# Altium schematic sheet TOP.SchDoc
size A4
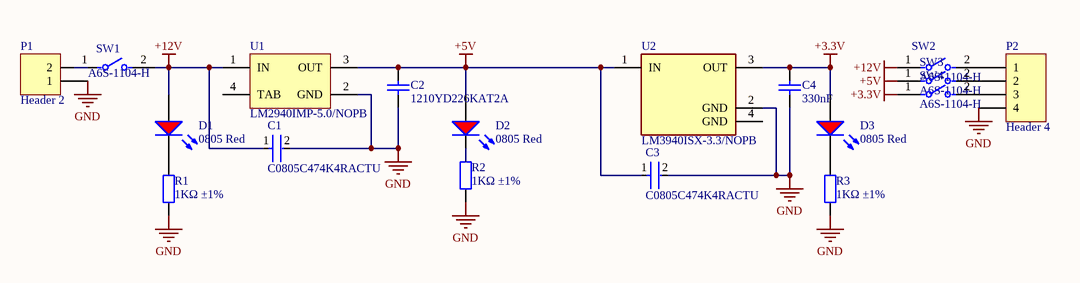
[diagram p0: TOP.SchDoc]

## Parts
C1  C0805C474K4RACTU  [FP-C0805C-DN-MFG]
C2  1210YD226KAT2A  [CAPC3225X279X50LL20T25]
C3  C0805C474K4RACTU  [FP-C0805C-DN-MFG]
C4  330nF  [0603_C]
D1  0805 Red  [0805_LED_S1]
D2  0805 Red  [0805_LED_S1]
D3  0805 Red  [0805_LED_S1]
P1  Header 2  [HDR1X2]
P2  Header 4  [HDR1X4]
R1  1KΩ ±1%  [0805_R]
R2  1KΩ ±1%  [0805_R]
R3  1KΩ ±1%  [0805_R]
SW1  A6S-1104-H  [FP-A6S-1104-H-MFG]
SW2  A6S-1104-H  [FP-A6S-1104-H-MFG]
SW3  A6S-1104-H  [FP-A6S-1104-H-MFG]
SW4  A6S-1104-H  [FP-A6S-1104-H-MFG]
U1  LM2940IMP-5.0/NOPB  [DCY0004A_M]
U2  LM3940ISX-3.3/NOPB  [FP-KTT0003B-MFG]

## Nets
+3.3V: C4.2 D3.A SW4.1 U2.3(OUT)
+5V: C2.2 C3.1 D2.A SW3.1 U1.3(OUT) U2.1(IN)
+12V: C1.1 D1.A SW1.2 SW2.1 U1.1(IN)
GND: C1.2 C2.1 C3.2 C4.1 P1.1 P2.4 R1.1 R2.1 R3.1 U1.2(GND) U2.2(GND)
NetD1_K: D1.K R1.2
NetD2_K: D2.K R2.2
NetD3_K: D3.K R3.2
NetP1_2: P1.2 SW1.1
NetP2_1: P2.1 SW2.2
NetP2_2: P2.2 SW3.2
NetP2_3: P2.3 SW4.2

Not connected (* = marked no-connect by the designer): U1 4(TAB); U2 4(GND)

## Library data of the parts
C1 C3 = CMP-2007-03296-2: CAP CER 0.47UF 16V 10% X7R 0805; Manufacturer: KEMET; Value: 0.47 μF; Temperature Coefficient: 30ppm/°C; Description: C0805 0.47 μF X7R 30ppm/°C 10.00% 16 V; Tolerance: 0.1; Material: Ceramic; Device Class L3: Ceramic Capacitors; RoHS: TRUE; ComponentLink2Description: Datasheet; Digikey Description: CAP CER 0.47UF 16V 10% X7R 0805; Temperature Characteristic: X7R; Device Class L1: Passive Components; Device Class L2: Capacitors; Octopart: https://octopart.com/c0805c474k4ractu-kemet-107561; Category: Cap; Ipc Land Pattern Name: CAPC200125X78; Package: C0805C-DN; Capacitance: 0.47 μF; ComponentLink2URL: https://content.kemet.com/datasheets/KEM_C1003_C0G_SMD.pdf; Automotive: No; Height: 0.88mm; Temperature: -55°C to +125°C; Manufacturer Part Number: C0805C474K4RACTU; Voltage Rating: 16 V; Temperature Range High: +125°C; Lead Free: Yes; Mouser Description: Multilayer Ceramic Capacitor, C Series, 0.47 - F, - 10%, X7r, 16 V, 0805 [2012 Metric] Rohs Compliant: Yes; Temperature Range Low: -55°C
C2 = CMP-2000-05483-1: Chip Capacitor, 22 uF, +/- 10%, 16 V, -55 to 85 degC, 1210 (3225 Metric), RoHS, Tape and Reel; Manufacturer: AVX; Rated Voltage: 16V; Dielectric: X5R; Capacitance: 22µF; Tolerance (%): ±10%; Datasheet Version: 05/2016; Case Size/Dimension: 1210; Package Reference: 1210; Package Description: 2-Pin Surface Mount Device, Body 3.2 x 2.5 mm; Mounting Technology: SurfaceMount; Manufacturer URL: http://www.avx.com/; Datasheet URL: http://datasheets.avx.com/cx5r.pdf
C4 = 0603 330nF (334) 10% 25V: Chip capacitors; Manufacturer: Guangdong Fenghua Advanced Tech; PartNumber: 0603B334K250NT; Tolerance: 10%; Voltage: 25V; ComponentLink1Description: Supplier link; ComponentLink1URL: http://www.szlcsc.com/product/details_1967.html; Package: 0603; Supplier: LC; SuppliersPartNumber: C1615; Capacitance: 330nF
D1-D3 = 0805 LED Red: LED; PartNumber: FC-2012HRK-620D; Manufacturer: Foshan NationStar Optoelectronics; ComponentLink1Description: 供应商链接; ComponentLink1URL: http://www.szlcsc.com/product/details_2668.html; Package: 0805; Supplier: LC; SuppliersPartNumber: C84256; Color: Red
P1 = Header 2: Header, 2-Pin; LatestRevisionDate: 17-Jul-2002; LatestRevisionNote: Re-released for DXP Platform.; Publisher: Altium Limited
P2 = Header 4: Header, 4-Pin; LatestRevisionDate: 17-Jul-2002; LatestRevisionNote: Re-released for DXP Platform.; Publisher: Altium Limited
R1-R3 = 0805 1K (1001) 1%: Chip resistor; Manufacturer: Uniroyal Elec; PartNumber: 0805W8F1001T5E; Power: 1/8W; ComponentLink1Description: Supplier link; ComponentLink1URL: http://www.szlcsc.com/product/details_18201.html; Package: 0805; Supplier: LC; SuppliersPartNumber: C17513; Resistance: 1KΩ; Tolerance: 1%
SW1-SW4 = CMP-08827-000005-1: SWITCH SLIDE DIP SPST 25MA 24V; Manufacturer: Omron Electronics Inc-EMC Div; Description: Switch DIP 1 way Raised Slide SMT; Throw Configuration: SPST-NO; Standoff Height: 0mm; Number Of Circuits: 1; Electromechanical Life: 1000Cycles; Contact Resistance: 200mΩ; Digikey Description: SWITCH SLIDE DIP SPST 25MA 24V; ComponentLink2Description: Datasheet; Mount: Surface Mount; Manufacturer Part Number: A6S-1104-H; ComponentLink2URL: https://omronfs.omron.com/en_US/ecb/products/pdf/en-a6s.pdf; Category: Switch; Height: 3.95mm; Device Class L3: DIP Switches; Octopart: https://octopart.com/a6s-1104-h-omron-55410938; Mouser Description: DIP Switches / SIP Switches Dip Switch; Lead Free: Yes; Temperature Range Low: -20°C; Temperature Range High: +70°C; Automotive: No; Ambient Temperature Range Low: -20°C; Ambient Temperature Range High: +70°C; Voltage Rating Dc: 24V; Device Class L2: Switches; RoHS: TRUE; Package: 0; Contact Current Rating: 25mA; Device Class L1: Electromechanical; Temperature: -20°C to +70°C
U1 = CMP-0062-01724-3: 1A Low Dropout Regulator, 4-pin SOT-223, Pb-Free; Manufacturer: Texas Instruments; PowerWise: N; PackageTopMarking: XYTT*L53B; CompType: LDO IC; PinCount: 4; ComponentLink1Description: Datasheet URL; PackageDescription: Molded SOT-223, 6.50 x 3.56 x 1.6mm Body, 4 Lead, 2.3mm Pitch; Code_JEDEC: TO-261-AA; PackageReference: DCY0004A; RoHS: Y; ComponentLink1URL: http://www.ti.com/general/docs/lit/getliterature.tsp?genericPartNumber=LM2940-N&fileType=pdf; Code_IPC: SOT223-4
U2 = CMP-04917-000003-1: IC REG LIN 3.3V 1A DDPAK/TO263-3; Manufacturer: Texas Instruments; Accuracy Percentage: 2.5%; Min Supply Voltage: 4.5V; Max Junction Temp: +125°C; Dropout Voltage: 0.5V; Number Of Outputs: 1; Output Type: Fixed; Max Supply Voltage: 5.5V; Standoff Height: 0mm; Nominal Supply Current: 10-110mA; Device Class L3: Voltage Regulators - Linear; Octopart: https://octopart.com/lm3940isx-3.3%2Fnopb-texas+instruments-24814218; Digikey Description: IC REG LIN 3.3V 1A DDPAK/TO263-3; Manufacturer Part Number: LM3940ISX-3.3/NOPB; ComponentLink2URL: http://www.ti.com/lit/ds/symlink/lm3940.pdf; Automotive: No; Category: IC; Device Class L2: Power Management ICs; Package: KTT0003B; Device Class L1: Integrated Circuits (ICs); Output Current: 1A; Output Voltage: 3.3V; Mouser Description: LDO Voltage Regulators 1A LDO REG; Height: 4.79mm; Lead Free: Yes; Temperature Range High: +125°C; Temperature Range Low: -40°C; Temperature: -40°C to +125°C; RoHS: TRUE; ComponentLink2Description: Datasheet